# EAGLE schematic Cosmic Pi V2 (EAGLE 9.1.0)

## Sheet 1 of 2
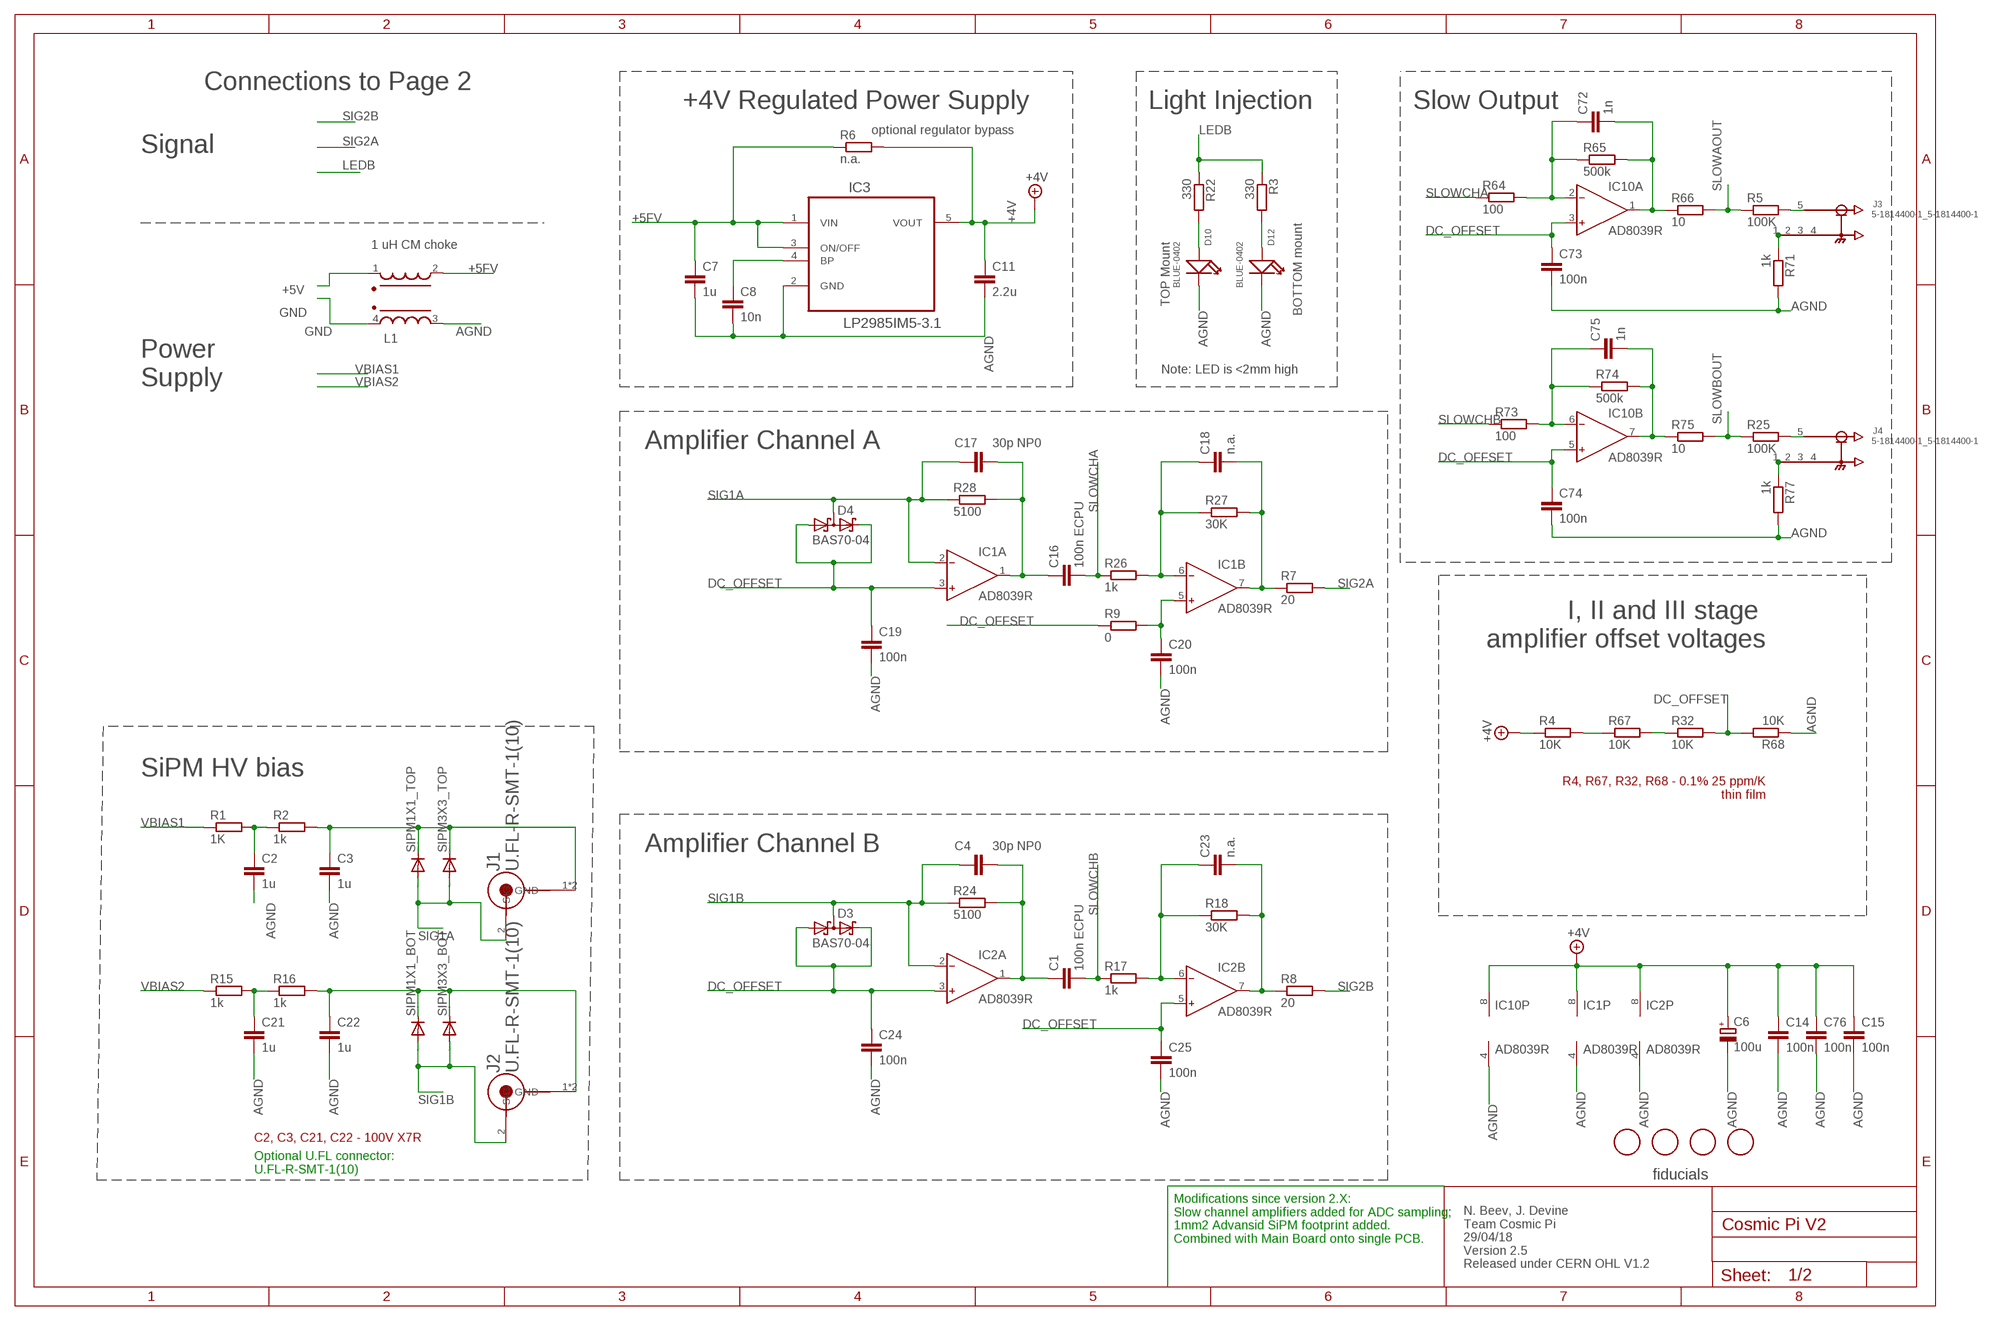
[diagram p0: schematic, sheet 1]

### Parts
C1  100n ECPU  C-EUC0805  [C0805]
C2  1u  C-EUC1206  [C1206]
C3  1u  C-EUC1206  [C1206]
C4  30p NP0  C-EUC0603  [C0603]
C6  100u  CPOL-EUC/6032-28R  [C/6032-28R]
C7  1u  C-EUC0603  [C0603]
C8  10n  C-EUC0603  [C0603]
C11  2.2u  C-EUC0603  [C0603]
C14  100n  C-EUC0603  [C0603]
C15  100n  C-EUC0603  [C0603]
C16  100n ECPU  C-EUC0805  [C0805]
C17  30p NP0  C-EUC0603  [C0603]
C18  n.a.  C-EUC0603  [C0603]
C19  100n  C-EUC0603  [C0603]
C20  100n  C-EUC0603  [C0603]
C21  1u  C-EUC1206  [C1206]
C22  1u  C-EUC1206  [C1206]
C23  n.a.  C-EUC0603  [C0603]
C24  100n  C-EUC0603  [C0603]
C25  100n  C-EUC0603  [C0603]
C72  1n  C-EUC0603  [C0603]
C73  100n  C-EUC0603  [C0603]
C74  100n  C-EUC0603  [C0603]
C75  1n  C-EUC0603  [C0603]
C76  100n  C-EUC0603  [C0603]
D3  BAS70-04  [SOT23]
D4  BAS70-04  [SOT23]
D10  BLUE-0402  SMD-LED-CLEAR-BLUE(0402)  [LED-0402]
D12  BLUE-0402  SMD-LED-CLEAR-BLUE(0402)  [LED-0402]
IC1  AD8039R  [SO8]
IC2  AD8039R  [SO8]
IC3  LP2985IM5-3.1  [SOT95P284X120-5N]
IC10  AD8039R  [SO8]
J1  U.FL-R-SMT-1(10)  [HRS_U.FL-R-SMT-1(10)]
J2  U.FL-R-SMT-1(10)  [HRS_U.FL-R-SMT-1(10)]
J3  5-1814400-1_5-1814400-1  [5-1814400-1_TE_5-1814400-1]
J4  5-1814400-1_5-1814400-1  [5-1814400-1_TE_5-1814400-1]
L1  1 uH CM choke  WE-CNSW_1812_744235601  [WE-CNSW_1812]
R1  1K  R-EU_R1206  [R1206]
R2  1k  R-EU_R1206  [R1206]
R3  330  R-EU_R0603  [R0603]
R4  10K  R-EU_R0805  [R0805]
R5  100K  R-EU_R0603  [R0603]
R6  n.a.  R-EU_R0603  [R0603]
R7  20  R-EU_R0603  [R0603]
R8  20  R-EU_R0603  [R0603]
R9  0  R-EU_R1206  [R1206]
R15  1k  R-EU_R1206  [R1206]
R16  1k  R-EU_R1206  [R1206]
R17  1k  R-EU_R0603  [R0603]
R18  30K  R-EU_R0603  [R0603]
R22  330  R-EU_R0603  [R0603]
R24  5100  R-EU_R0603  [R0603]
R25  100K  R-EU_R0603  [R0603]
R26  1k  R-EU_R0603  [R0603]
R27  30K  R-EU_R0603  [R0603]
R28  5100  R-EU_R0603  [R0603]
R32  10K  R-EU_R0805  [R0805]
R64  100  R-EU_R0603  [R0603]
R65  500k  R-EU_R0603  [R0603]
R66  10  R-EU_R0603  [R0603]
R67  10K  R-EU_R0805  [R0805]
R68  10K  R-EU_R0805  [R0805]
R71  1k  R-EU_R0603  [R0603]
R73  100  R-EU_R0603  [R0603]
R74  500k  R-EU_R0603  [R0603]
R75  10  R-EU_R0603  [R0603]
R77  1k  R-EU_R0603  [R0603]
SIPM1X1_BOT  DIODE_DIODE-ADVANSID1X1  [DIODE_ASD-NUV1S-P]
SIPM1X1_TOP  DIODE_DIODE-ADVANSID1X1  [DIODE_ASD-NUV1S-P]
SIPM3X3_BOT  DIODE_DIODE-ADVANSID3X3  [DIODE_ASD-NUV3S-P]
SIPM3X3_TOP  DIODE_DIODE-ADVANSID3X3  [DIODE_ASD-NUV3S-P]
U$2  FIDUCIAL  [FIDUCIAL_1MM]
U$3  FIDUCIAL  [FIDUCIAL_1MM]
U$4  FIDUCIAL  [FIDUCIAL_1MM]
U$5  FIDUCIAL  [FIDUCIAL_1MM]

### Nets
+4V: C6.+ C11.1 C14.1 C15.1 C76.1 IC1.8(P:V+) IC2.8(P:V+) IC3.5(VOUT) IC10.8(P:V+) R4.1 R6.2
+5FV: C7.1 IC3.1(VIN) IC3.3(ON/OFF) L1.2 R6.1
+5V: L1.1 ; also sheet 2
AGND: C2.2 C3.2 C6.- C7.2 C8.2 C11.2 C14.2 C15.2 C19.2 C20.2 C21.2 C22.2 C24.2 C25.2 C73.2 C74.2 C76.2 D10.- D12.- IC1.4(P:V-) IC2.4(P:V-) IC3.2(GND) IC10.4(P:V-) L1.3 R68.1 R71.2 R77.2
DC_OFFSET: C19.1 C24.1 C25.1 C73.1 C74.1 D3.1(A1) D3.2(C2) D4.1(A1) D4.2(C2) IC1.3(A:IN+) IC2.3(A:IN+) IC2.5(B:IN+) IC10.3(A:IN+) IC10.5(B:IN+) R9.1 R32.2 R68.2
GND: L1.4 ; also sheet 2
LEDB: R3.1 R22.1 ; also sheet 2
N$1: J3.5(SIG) R5.2
N$2: R4.2 R67.1
N$3: D12.+ R3.2
N$4: C8.1 IC3.4(BP)
N$5: C21.1 R15.2 R16.1
N$6: C18.2 IC1.7(B:OUT) R7.1 R27.2
N$7 [Comms]: C22.1 J2.1(GND) J2.3(GND) R16.2 SIPM1X1_BOT.P$1(C) SIPM3X3_BOT.P$1(C)
N$8: J4.5(SIG) R25.2
N$9: C23.2 IC2.7(B:OUT) R8.1 R18.2
N$11: C2.1 R1.2 R2.1
N$12: C72.1 IC10.2(A:IN-) R64.2 R65.1
N$13: C20.1 IC1.5(B:IN+) R9.2
N$18 [Comms]: C3.1 J1.1(GND) J1.3(GND) R2.2 SIPM1X1_TOP.P$1(C) SIPM3X3_TOP.P$1(C)
N$20: D10.+ R22.2
N$21: R32.1 R67.2
N$23: C1.1 C4.2 IC2.1(A:OUT) R24.2
N$24: J4.1(GND) R77.1
N$25: C23.1 IC2.6(B:IN-) R17.2 R18.1
N$31: C16.1 C17.2 IC1.1(A:OUT) R28.2
N$32: C72.2 IC10.1(A:OUT) R65.2 R66.1
N$33: C18.1 IC1.6(B:IN-) R26.2 R27.1
N$59: C75.1 IC10.6(B:IN-) R73.2 R74.1
N$76: J3.1(GND) R71.1
N$77: C75.2 IC10.7(B:OUT) R74.2 R75.1
SIG1A [Comms]: C17.1 D4.3(C1A2) IC1.2(A:IN-) J1.2(SIG) R28.1 SIPM1X1_TOP.P$2(A) SIPM3X3_TOP.P$2(A)
SIG1B [Comms]: C4.1 D3.3(C1A2) IC2.2(A:IN-) J2.2(SIG) R24.1 SIPM1X1_BOT.P$2(A) SIPM3X3_BOT.P$2(A)
SIG2A [Comms]: R7.2 ; also sheet 2
SIG2B [Comms]: R8.2 ; also sheet 2
SLOWAOUT: R5.1 R66.2 ; also sheet 2
SLOWBOUT: R25.1 R75.2 ; also sheet 2
SLOWCHA [Comms]: C16.2 R26.1 R64.1
SLOWCHB: C1.2 R17.1 R73.1
VBIAS1: R1.1 ; also sheet 2
VBIAS2: R15.1 ; also sheet 2
Unconnected: J3.2(GND) J3.3(GND) J3.4(GND) J4.2(GND) J4.3(GND) J4.4(GND)

### Notes on the sheet
- Connections to Page 2
- +4V Regulated Power Supply | Light Injection | Slow Output
- optional regulator bypass
- Signal
- Note: LED is <2mm high
- Power
  Supply
- Amplifier Channel A
- I, II and III stage 
  amplifier offset voltages
- SiPM HV bias
- R4, R67, R32, R68 - 0.1% 25 ppm/K
  thin film
- Amplifier Channel B
- C2, C3, C21, C22 - 100V X7R
- Optional U.FL connector:
  U.FL-R-SMT-1(10)
- fiducials
- Modifications since version 2.X:
  Slow channel amplifiers added for ADC sampling;
  1mm2 Advansid SiPM footprint added.
  Combined with Main Board onto single PCB.
- N. Beev, J. Devine
  Team Cosmic Pi
  29/04/18
  Version 2.5
  Released under CERN OHL V1.2

## Sheet 2 of 2
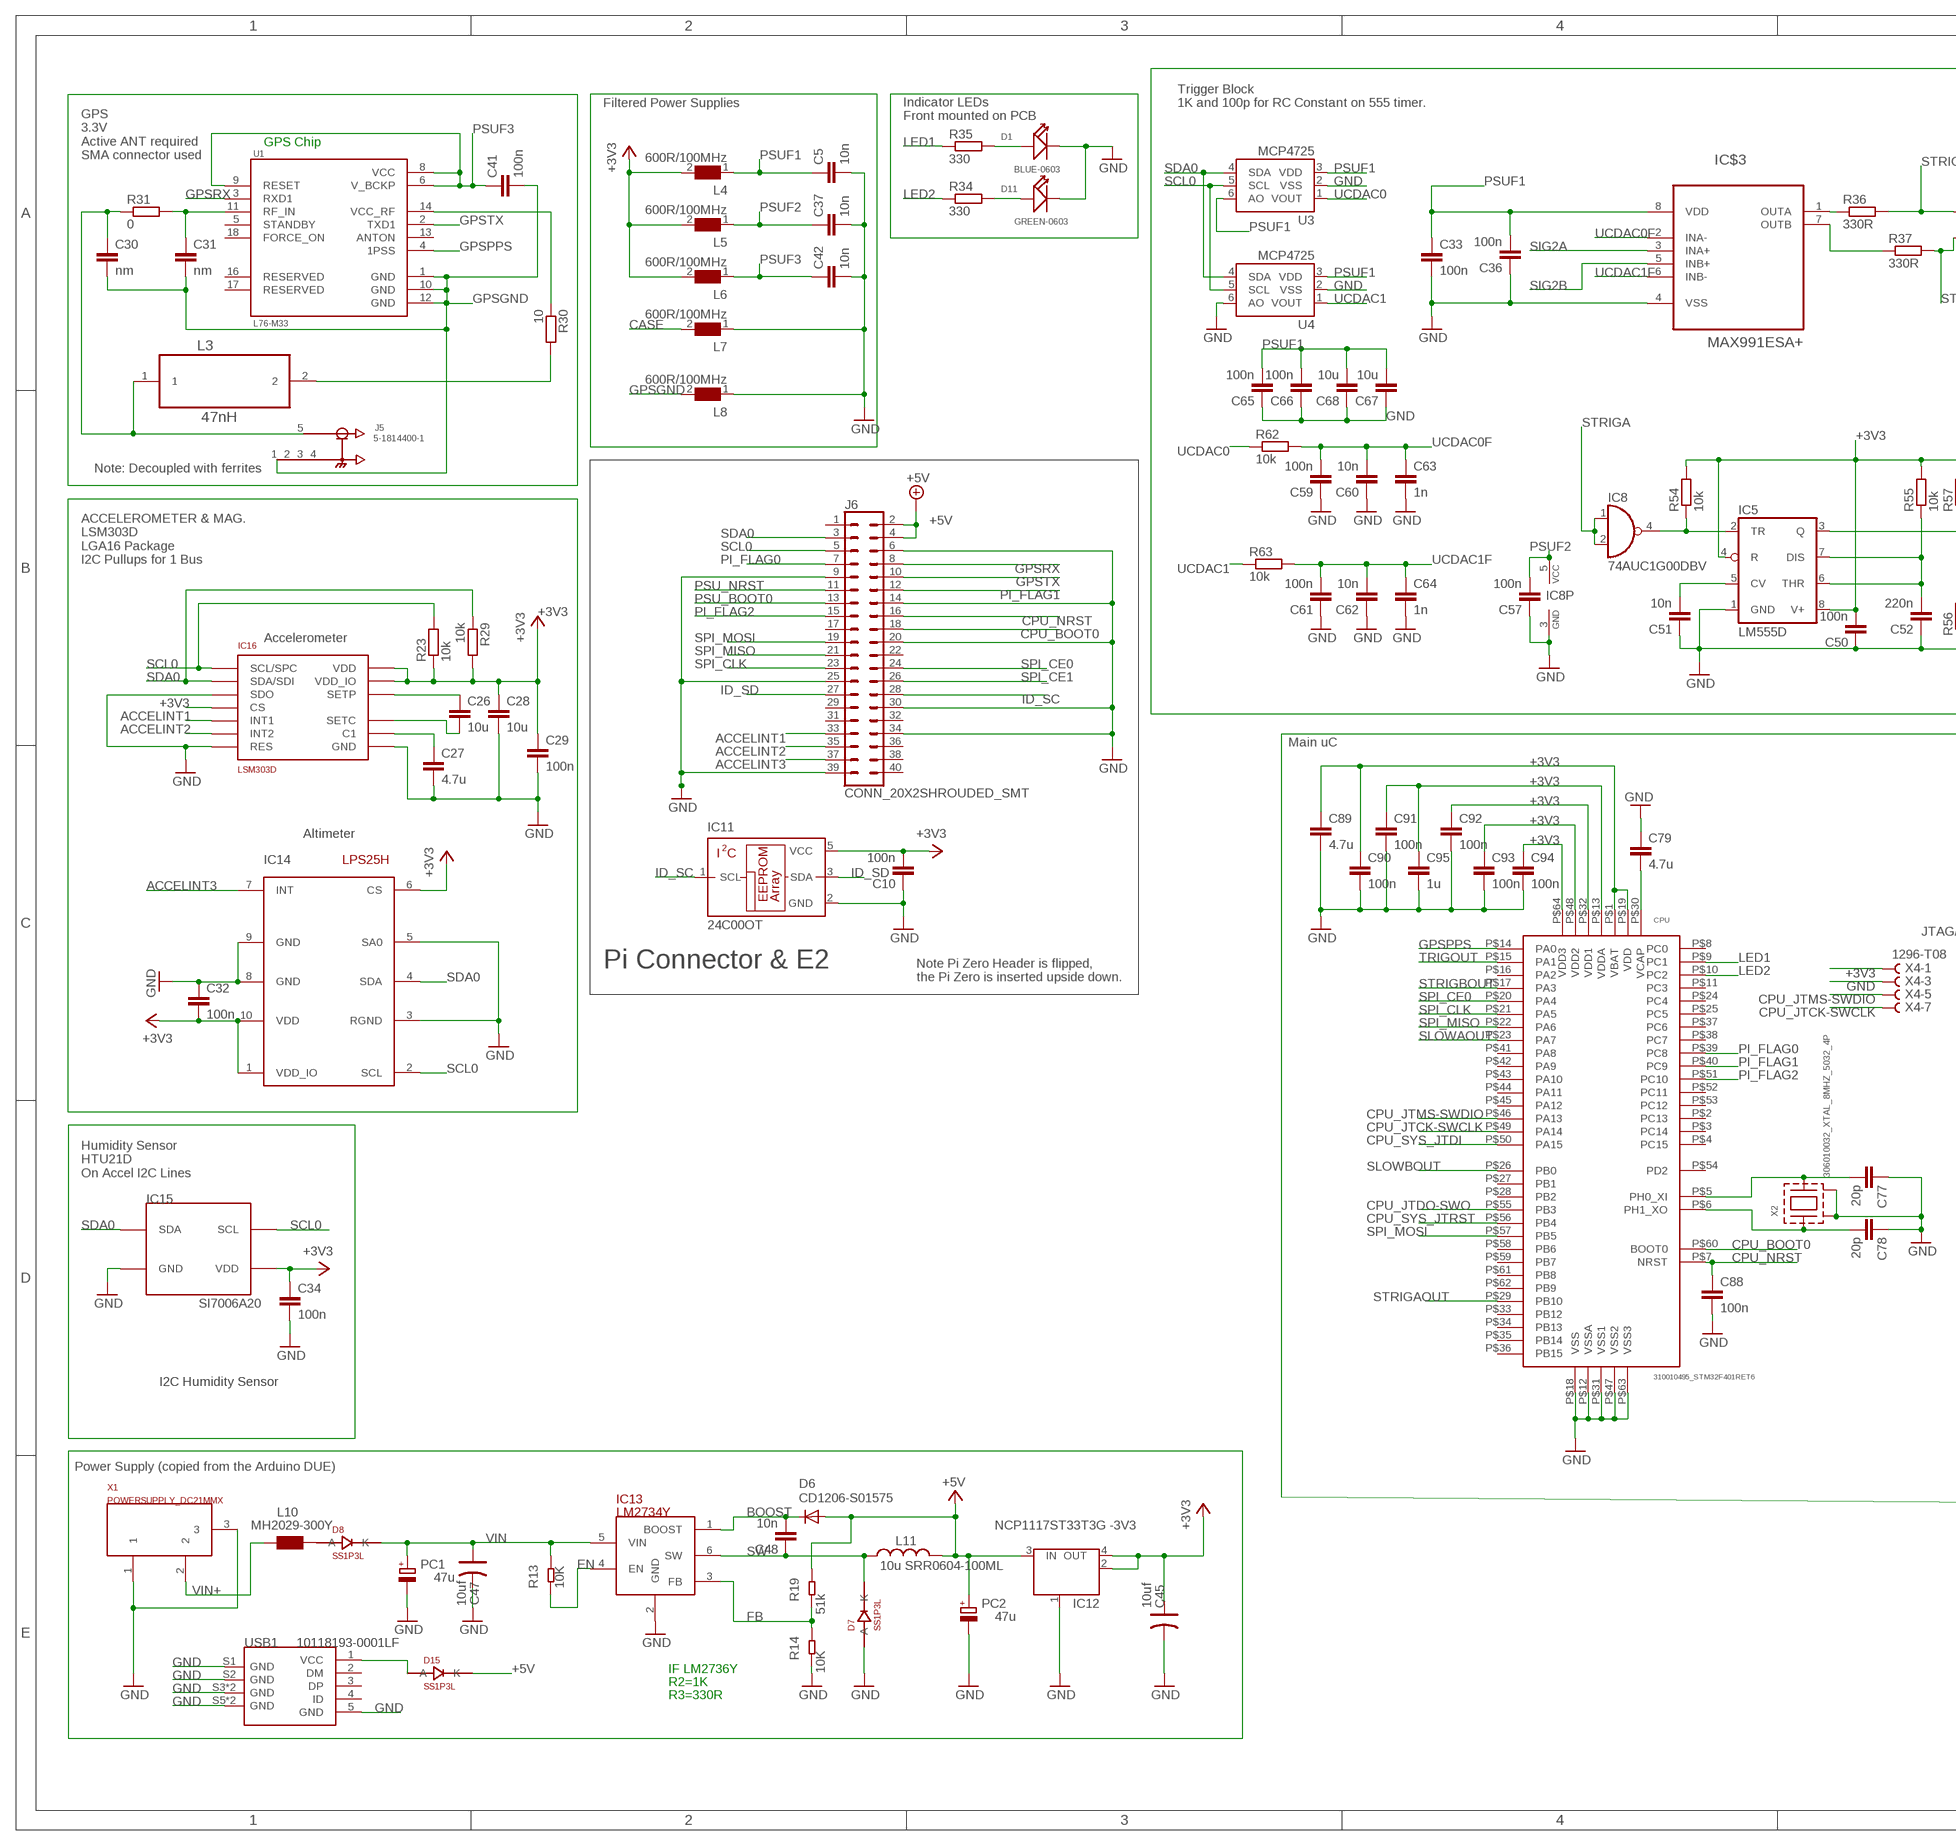
[diagram p1: schematic, sheet 2, part 1 of 2]
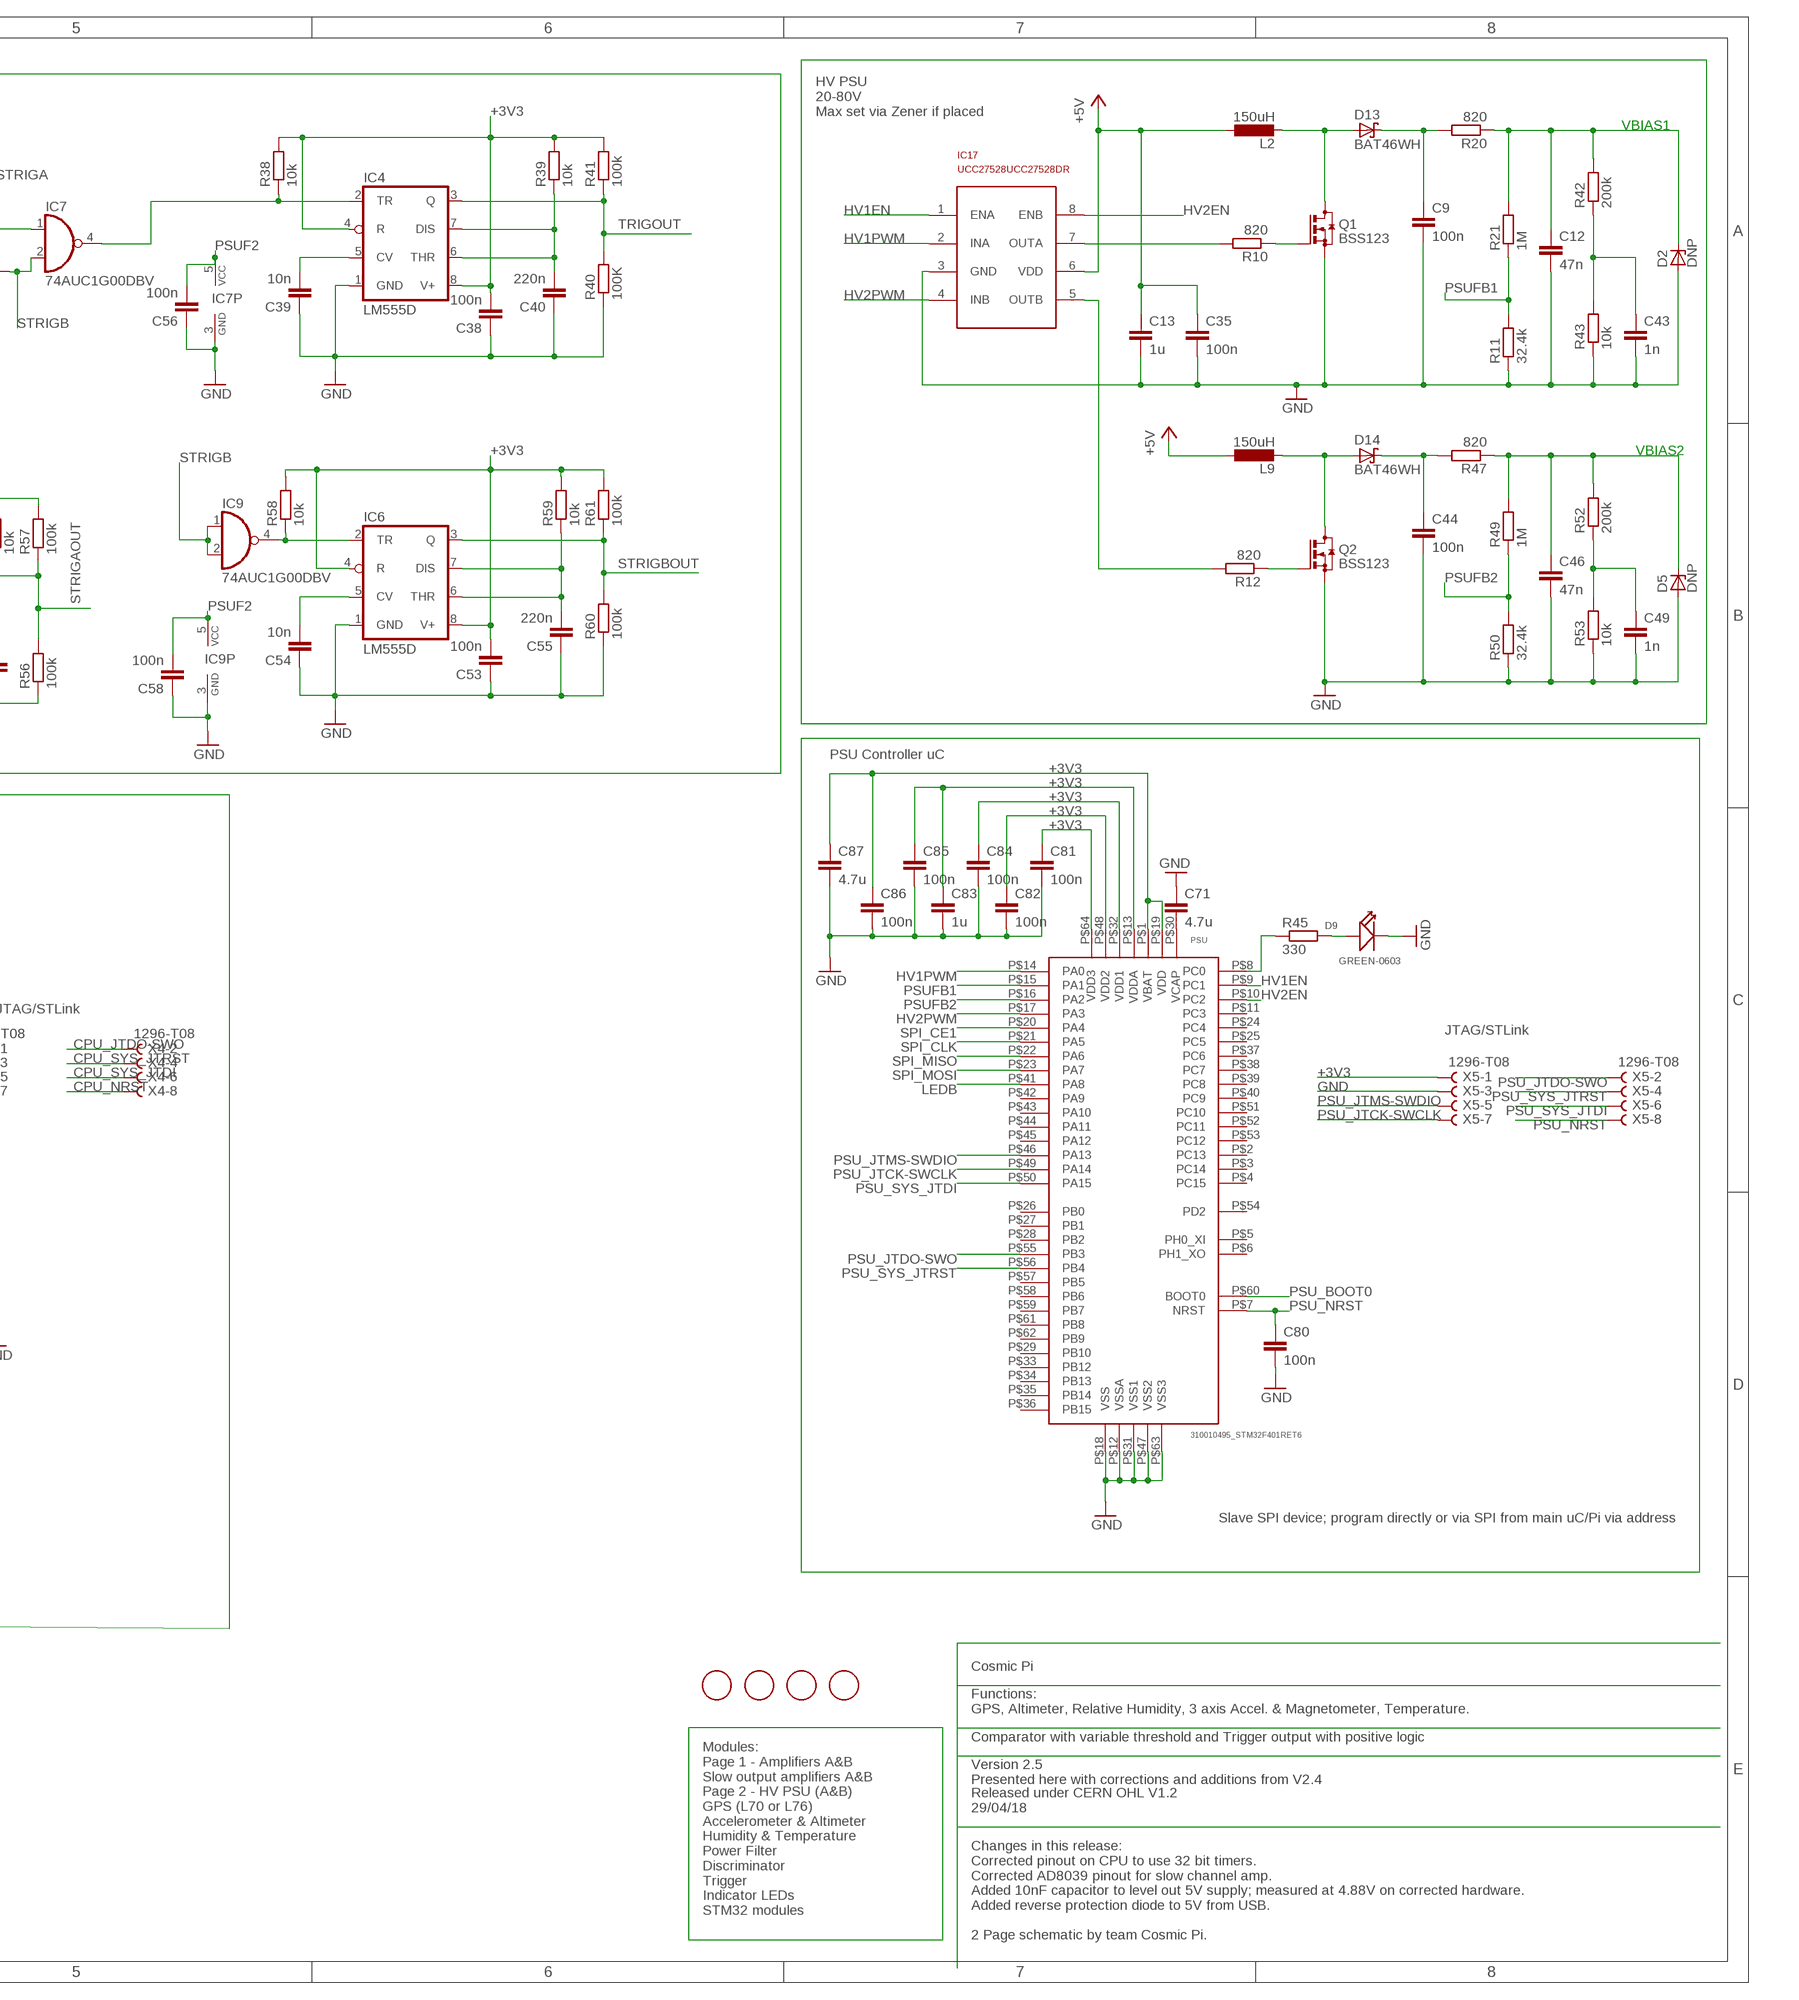
[diagram p2: schematic, sheet 2, part 2 of 2]

### Parts
C5  10n  C-EUC0603  [C0603]
C9  100n  C-EUC0603  [C0603]
C10  100n  C-EUC0603  [C0603]
C12  47n  C-EUC0603  [C0603]
C13  1u  C-EUC0603  [C0603]
C26  10u  C-EUC0603  [C0603]
C27  4.7u  C-EUC0603  [C0603]
C28  10u  C-EUC0603  [C0603]
C29  100n  C-EUC0603  [C0603]
C30  nm  C-EUC0603  [C0603]
C31  nm  C-EUC0603  [C0603]
C32  100n  C-EUC0603  [C0603]
C33  100n  C-EUC0603  [C0603]
C34  100n  C-EUC0603  [C0603]
C35  100n  C-EUC0603  [C0603]
C36  100n  C-EUC0603  [C0603]
C37  10n  C-EUC0603  [C0603]
C38  100n  C-EUC0603  [C0603]
C39  10n  C-EUC0603  [C0603]
C40  220n  C-EUC0603  [C0603]
C41  100n  C-EUC0603  [C0603]
C42  10n  C-EUC0603  [C0603]
C43  1n  C-EUC0603  [C0603]
C44  100n  C-EUC0603  [C0603]
C45  10uf  TANTALUM-SMD-10UF-16V-10%(AVX-A)  [AVX-A]
C46  47n  C-EUC0603  [C0603]
C47  10uf  TANTALUM-SMD-10UF-16V-10%(AVX-A)  [AVX-A]
C48  10n  C-EUC0603  [C0603]
C49  1n  C-EUC0603  [C0603]
C50  100n  C-EUC0603  [C0603]
C51  10n  C-EUC0603  [C0603]
C52  220n  C-EUC0603  [C0603]
C53  100n  C-EUC0603  [C0603]
C54  10n  C-EUC0603  [C0603]
C55  220n  C-EUC0603  [C0603]
C56  100n  C-EUC0603  [C0603]
C57  100n  C-EUC0603  [C0603]
C58  100n  C-EUC0603  [C0603]
C59  100n  C-EUC0603  [C0603]
C60  10n  C-EUC0603  [C0603]
C61  100n  C-EUC0603  [C0603]
C62  10n  C-EUC0603  [C0603]
C63  1n  C-EUC0603  [C0603]
C64  1n  C-EUC0603  [C0603]
C65  100n  C-EUC0603  [C0603]
C66  100n  C-EUC0603  [C0603]
C67  10u  C-EUC0603  [C0603]
C68  10u  C-EUC0603  [C0603]
C71  4.7u  C-EUC0603  [C0603]
C77  20p  C-EUC0603  [C0603]
C78  20p  C-EUC0603  [C0603]
C79  4.7u  C-EUC0603  [C0603]
C80  100n  C-EUC0603  [C0603]
C81  100n  C-EUC0603  [C0603]
C82  100n  C-EUC0603  [C0603]
C83  1u  C-EUC0603  [C0603]
C84  100n  C-EUC0603  [C0603]
C85  100n  C-EUC0603  [C0603]
C86  100n  C-EUC0603  [C0603]
C87  4.7u  C-EUC0603  [C0603]
C88  100n  C-EUC0603  [C0603]
C89  4.7u  C-EUC0603  [C0603]
C90  100n  C-EUC0603  [C0603]
C91  100n  C-EUC0603  [C0603]
C92  100n  C-EUC0603  [C0603]
C93  100n  C-EUC0603  [C0603]
C94  100n  C-EUC0603  [C0603]
C95  1u  C-EUC0603  [C0603]
CPU  310010495_STM32F401RET6  [LQFP64]
D1  BLUE-0603  SMD-LED-CLEAR-BLUE(0603)  [LED-0603]
D2  DNP  ZENER-DIODESOT23  [SOT23]
D5  DNP  ZENER-DIODESOT23  [SOT23]
D6  CD1206-S01575  DIODE-MINIMELF  [MINIMELF]
D7  SS1P3L  [DO220AAL]
D8  SS1P3L  [DO220AAL]
D9  GREEN-0603  SMD-LED-CLEAR-GREEN(0603)  [LED-0603]
D11  GREEN-0603  SMD-LED-CLEAR-GREEN(0603)  [LED-0603]
D13  BAT46WH  [SOD123F]
D14  BAT46WH  [SOD123F]
D15  SS1P3L  [DO220AAL]
IC4  LM555D  [SO08]
IC5  LM555D  [SO08]
IC6  LM555D  [SO08]
IC7  74AUC1G00DBV  [SOT23-5]
IC8  74AUC1G00DBV  [SOT23-5]
IC9  74AUC1G00DBV  [SOT23-5]
IC11  24C00OT  [SOT23-5L]
IC12  NCP1117ST33T3G -3V3  MC33269ST-3.3T3  [SOT223]
IC13  LM2734Y  LM2736Y  [SOT23-6]
IC14  LPS25H  [LPS25H]
IC15  SI7006A20  [3X3DFN]
IC16  LSM303D  [LGA16L]
IC17  UCC27528UCC27528DR  [ANALOG-DEVICES_SO8]
IC$3  MAX991ESA+  [SOIC-8]
J5  5-1814400-1  [TE_5-1814400-1]
J6  CONN_20X2SHROUDED_SMT  [2X20_SHROUDED_SMT]
L2  150uH  L-EUL1812  [L1812]
L3  47nH  B82496C3470J  [INDC1608X90N]
L4  600R/100MHz  WE-CBF-74279218_1206  [1206]
L5  600R/100MHz  WE-CBF-74279218_1206  [1206]
L6  600R/100MHz  WE-CBF-74279218_1206  [1206]
L7  600R/100MHz  WE-CBF-74279218_1206  [1206]
L8  600R/100MHz  WE-CBF-74279218_1206  [1206]
L9  150uH  L-EUL1812  [L1812]
L10  MH2029-300Y  WE-CBF_0805  [0805]
L11  10u SRR0604-100ML  L-USSRR0604  [SRR0604]
PC1  47u  CPOL-EUD  [PANASONIC_D]
PC2  47u  CPOL-EUD  [PANASONIC_D]
PSU  310010495_STM32F401RET6  [LQFP64]
Q1  BSS123  [SOT23]
Q2  BSS123  [SOT23]
R10  820  R-EU_R0603  [R0603]
R11  32.4k  R-EU_R0603  [R0603]
R12  820  R-EU_R0603  [R0603]
R13  10K  SMD-RES-10K-1%-1/10W(0603)  [R0603]
R14  10K  SMD-RES-10K-1%-1/10W(0603)  [R0603]
R19  51k  SMD-RES-51K-5%-1/10W(0603)  [R0603]
R20  820  R-EU_R0603  [R0603]
R21  1M  R-EU_R0603  [R0603]
R23  10k  R-EU_R0603  [R0603]
R29  10k  R-EU_R0603  [R0603]
R30  10  R-EU_R0603  [R0603]
R31  0  R-EU_R0603  [R0603]
R34  330  R-EU_R0603  [R0603]
R35  330  R-EU_R0603  [R0603]
R36  330R  R-EU_R0603  [R0603]
R37  330R  R-EU_R0603  [R0603]
R38  10k  R-EU_R0603  [R0603]
R39  10k  R-EU_R0603  [R0603]
R40  100K  R-EU_R0603  [R0603]
R41  100k  R-EU_R0603  [R0603]
R42  200k  R-EU_R0603  [R0603]
R43  10k  R-EU_R0603  [R0603]
R45  330  R-EU_R0603  [R0603]
R47  820  R-EU_R0603  [R0603]
R49  1M  R-EU_R0603  [R0603]
R50  32.4k  R-EU_R0603  [R0603]
R52  200k  R-EU_R0603  [R0603]
R53  10k  R-EU_R0603  [R0603]
R54  10k  R-EU_R0603  [R0603]
R55  10k  R-EU_R0603  [R0603]
R56  100k  R-EU_R0603  [R0603]
R57  100k  R-EU_R0603  [R0603]
R58  10k  R-EU_R0603  [R0603]
R59  10k  R-EU_R0603  [R0603]
R60  100k  R-EU_R0603  [R0603]
R61  100k  R-EU_R0603  [R0603]
R62  10k  R-EU_R0603  [R0603]
R63  10k  R-EU_R0603  [R0603]
U1  L76-M33  [CAPCAV110P970X1010X250-18N]
U3  MCP4725  MCP4725SOT-23  [SOT23-6]
U4  MCP4725  MCP4725SOT-23  [SOT23-6]
U$1  FIDUCIAL  [FIDUCIAL_1MM]
U$6  FIDUCIAL  [FIDUCIAL_1MM]
U$7  FIDUCIAL  [FIDUCIAL_1MM]
U$8  FIDUCIAL  [FIDUCIAL_1MM]
USB1  10118193-0001LF  MICRO-USB-SMD-B-(10118193-0001LF)  [MICRO-USB5+6P-SMD-0.65-B]
X1  POWERSUPPLY_DC21MMX  [POWERSUPPLY_DC-21MM]
X2  306010032_XTAL_8MHZ_5032_4P  [X5032_4P]
X4  1296-T08  [1296-08]
X5  1296-T08  [1296-08]

### Nets
+3V3: C10.2 C28.1 C29.1 C32.2 C34.1 C38.2 C45.+ C50.2 C53.2 C81.1 C82.1 C83.1 C84.1 C85.1 C86.1 C87.1 C89.1 C90.1 C91.1 C92.1 C93.1 C94.1 C95.1 CPU.P$1(VBAT) CPU.P$13(VDDA) CPU.P$19(VDD) CPU.P$32(VDD1) CPU.P$48(VDD2) CPU.P$64(VDD3) IC4.4(R) IC4.8(V+) IC5.4(R) IC5.8(V+) IC6.4(R) IC6.8(V+) IC11.5(VCC) IC12.2(OUT) IC12.4(OUT) IC14.1(VDD_IO) IC14.6(CS) IC14.10(VDD) IC15.P$5(VDD) IC16.P$1(VDD_IO) IC16.P$8(CS) IC16.P$14(VDD) L4.2 L5.2 L6.2 PSU.P$1(VBAT) PSU.P$13(VDDA) PSU.P$19(VDD) PSU.P$32(VDD1) PSU.P$48(VDD2) PSU.P$64(VDD3) R23.1 R29.2 R38.2 R39.2 R41.2 R54.2 R55.2 R57.2 R58.2 R59.2 R61.2 X4.1 X5.1
+5V: C13.1 C35.1 D6.A D15.P$1(K) IC12.3(IN) IC17.6(VDD) J6.2 J6.4 L2.1 L9.1 L11.P$2 PC2.+ R19.1 ; also sheet 1
ACCELINT1: IC16.P$11(INT1) J6.33
ACCELINT2: IC16.P$9(INT2) J6.35
ACCELINT3: IC14.7(INT) J6.37
BOOST: C48.2 D6.C IC13.1(BOOST)
CASE: L7.2
CPU_BOOT0: CPU.P$60(BOOT0) J6.18
CPU_JTCK-SWCLK: CPU.P$49(PA14) X4.7
CPU_JTDO-SWO: CPU.P$55(PB3) X4.2
CPU_JTMS-SWDIO: CPU.P$46(PA13) X4.5
CPU_NRST: C88.1 CPU.P$7(NRST) J6.16 X4.8
CPU_SYS_JTDI: CPU.P$50(PA15) X4.6
CPU_SYS_JTRST: CPU.P$56(PB4) X4.4
EN: IC13.4(EN) R13.2
FB: IC13.3(FB) R14.1 R19.2
GND: C5.2 C9.2 C10.1 C12.2 C13.2 C27.2 C28.2 C29.2 C32.1 C33.2 C34.2 C35.2 C36.1 C37.2 C38.1 C39.1 C40.1 C42.2 C43.2 C44.2 C45.- C46.2 C47.- C49.2 C50.1 C51.1 C52.1 C53.1 C54.1 C55.1 C56.1 C57.1 C58.1 C59.1 C60.1 C61.1 C62.1 C63.2 C64.2 C65.1 C66.1 C67.1 C68.1 C71.1 C77.1 C78.1 C79.1 C80.2 C81.2 C82.2 C83.2 C84.2 C85.2 C86.2 C87.2 C88.2 C89.2 C90.2 C91.2 C92.2 C93.2 C94.2 C95.2 CPU.P$12(VSSA) CPU.P$18(VSS) CPU.P$31(VSS1) CPU.P$47(VSS2) CPU.P$63(VSS3) D1.- D2.1(A) D5.1(A) D7.P$2(A) D9.- D11.- IC4.1(GND) IC5.1(GND) IC6.1(GND) IC7.3(GND) IC8.3(GND) IC9.3(GND) IC11.2(GND) IC12.1(GND/ADJ) IC13.2(GND) IC14.3(RGND) IC14.5(SA0) IC14.8(GND) IC14.9(GND) IC15.P$2(GND) IC16.P$5(GND) IC16.P$7(SDO) IC16.P$10(RES) IC16.P$12(GND) IC16.P$13(GND) IC16.P$16(GND) IC17.3(GND) IC$3.4(VSS) J6.6 J6.9 J6.14 J6.20 J6.25 J6.30 J6.34 J6.39 L7.1 L8.1 PC1.- PC2.- PSU.P$12(VSSA) PSU.P$18(VSS) PSU.P$31(VSS1) PSU.P$47(VSS2) PSU.P$63(VSS3) Q1.2(S) Q2.2(S) R11.1 R14.2 R40.1 R43.1 R50.1 R53.1 R56.1 R60.1 U3.2(VSS) U4.2(VSS) U4.6(AO) USB1.5(GND) USB1.S1(GND) USB1.S2(GND) USB1.S3(GND) USB1.S4(GND) USB1.S5(GND) USB1.S6(GND) X1.1 X1.3 X2.P$2(GND1) X2.P$4(GND2) X4.3 X5.3 ; also sheet 1
GPSGND [ant]: C30.2 C31.2 C41.2 J5.1(GND) L8.2 U1.1(GND) U1.10(GND) U1.12(GND)
GPSPPS: CPU.P$14(PA0) U1.4(1PSS)
GPSRX: J6.8 U1.3(RXD1)
GPSTX: J6.10 U1.2(TXD1)
HV1EN: IC17.1(ENA) PSU.P$9(PC1)
HV1PWM: IC17.2(INA) PSU.P$14(PA0)
HV2EN: IC17.8(ENB) PSU.P$10(PC2)
HV2PWM: IC17.4(INB) PSU.P$17(PA3)
ID_SC: IC11.1(SCL) J6.28
ID_SD: IC11.3(SDA) J6.27
LED1: CPU.P$9(PC1) R35.1
LED2: CPU.P$10(PC2) R34.1
LEDB: PSU.P$41(PA8) ; also sheet 1
N$10: D15.P$2(A) USB1.1(VCC)
N$16: D13.2(A) L2.2 Q1.3(D)
N$19: Q1.1(G) R10.1
N$22: C39.2 IC4.5(CV)
N$26: C40.2 IC4.6(THR) IC4.7(DIS) R39.1
N$27: Q2.1(G) R12.1
N$28: D14.2(A) L9.2 Q2.3(D)
N$30: C44.1 D14.1(K) R47.2
N$34: IC17.5(OUTB) R12.2
N$35: D9.+ R45.2
N$36: PSU.P$8(PC0) R45.1
N$39: C51.2 IC5.5(CV)
N$40: C52.2 IC5.6(THR) IC5.7(DIS) R55.1
N$41: C54.2 IC6.5(CV)
N$42: C55.2 IC6.6(THR) IC6.7(DIS) R59.1
N$43: IC4.2(TR) IC7.4(O) R38.1
N$44: IC6.2(TR) IC9.4(O) R58.1
N$45: IC5.2(TR) IC8.4(O) R54.1
N$46: IC$3.1(OUTA) R36.1
N$47: IC17.7(OUTA) R10.2
N$48: IC$3.7(OUTB) R37.1
N$53 [ant]: C30.1 J5.5(SIG) L3.1 R31.1
N$55: D8.P$2(A) L10.1
N$62: C71.2 PSU.P$30(VCAP)
N$63: C26.1 IC16.P$3(SETP)
N$64: C26.2 IC16.P$2(SETC)
N$65: C27.1 IC16.P$15(C1)
N$66 [ant]: L3.2 R30.2
N$67 [ant]: R30.1 U1.14(VCC_RF)
N$68 [ant]: C31.1 R31.2 U1.11(RF_IN)
N$72: D1.+ R35.2
N$73: D11.+ R34.2
N$75: C9.1 D13.1(K) R20.2
N$79: C77.2 CPU.P$5(PH0_XI) X2.P$3
N$81: C78.2 CPU.P$6(PH1_XO) X2.P$1
N$85: C79.2 CPU.P$30(VCAP)
PI_FLAG0: CPU.P$39(PC8) J6.7
PI_FLAG1: CPU.P$40(PC9) J6.12
PI_FLAG2: CPU.P$51(PC10) J6.15
PSU_BOOT0: J6.13 PSU.P$60(BOOT0)
PSU_JTCK-SWCLK: PSU.P$49(PA14) X5.7
PSU_JTDO-SWO: PSU.P$55(PB3) X5.2
PSU_JTMS-SWDIO: PSU.P$46(PA13) X5.5
PSU_NRST: C80.1 J6.11 PSU.P$7(NRST) X5.8
PSU_SYS_JTDI: PSU.P$50(PA15) X5.6
PSU_SYS_JTRST: PSU.P$56(PB4) X5.4
PSUF1: C5.1 C33.1 C36.2 C65.2 C66.2 C67.2 C68.2 IC$3.8(VDD) L4.1 U3.3(VDD) U3.6(AO) U4.3(VDD)
PSUF2: C37.1 C56.2 C57.2 C58.2 IC7.5(VCC) IC8.5(VCC) IC9.5(VCC) L5.1
PSUF3: C41.1 C42.1 L6.1 U1.6(V_BCKP) U1.8(VCC) U1.9(RESET)
PSUFB1: PSU.P$15(PA1) R11.2 R21.1
PSUFB2: PSU.P$16(PA2) R49.1 R50.2
SCL0: IC14.2(SCL) IC15.P$6(SCL) IC16.P$4(SCL/SPC) J6.5 R23.2 U3.5(SCL) U4.5(SCL)
SDA0: IC14.4(SDA) IC15.P$1(SDA) IC16.P$6(SDA/SDI) J6.3 R29.1 U3.4(SDA) U4.4(SDA)
SIG2A [Comms]: IC$3.3(INA+) ; also sheet 1
SIG2B [Comms]: IC$3.5(INB+) ; also sheet 1
SLOWAOUT: CPU.P$23(PA7) ; also sheet 1
SLOWBOUT: CPU.P$26(PB0) ; also sheet 1
SPI_CE0: CPU.P$20(PA4) J6.24
SPI_CE1: J6.26 PSU.P$20(PA4)
SPI_CLK: CPU.P$21(PA5) J6.23 PSU.P$21(PA5)
SPI_MISO: CPU.P$22(PA6) J6.21 PSU.P$22(PA6)
SPI_MOSI: CPU.P$57(PB5) J6.19 PSU.P$23(PA7)
STRIGA: IC7.1(I0) IC8.1(I0) IC8.2(I1) R36.2
STRIGAOUT: CPU.P$29(PB10) IC5.3(Q) R56.2 R57.1
STRIGB: IC7.2(I1) IC9.1(I0) IC9.2(I1) R37.2
STRIGBOUT: CPU.P$17(PA3) IC6.3(Q) R60.2 R61.1
SW: C48.1 D7.P$1(K) IC13.6(SW) L11.P$1
TRIGOUT: CPU.P$15(PA1) IC4.3(Q) R40.2 R41.1
UCDAC0: R62.1 U3.1(VOUT)
UCDAC0F: C59.2 C60.2 C63.1 IC$3.2(INA-) R62.2
UCDAC1: R63.1 U4.1(VOUT)
UCDAC1F: C61.2 C62.2 C64.1 IC$3.6(INB-) R63.2
VBIAS1: C12.1 D2.3(C) R20.1 R21.2 R42.2 ; also sheet 1
VBIAS2: C46.1 D5.3(C) R47.1 R49.2 R52.2 ; also sheet 1
VBIASFB1: C43.1 R42.1 R43.2
VBIASFB2: C49.1 R52.1 R53.2
VIN: C47.+ D8.P$1(K) IC13.5(VIN) PC1.+ R13.1
VIN+: L10.2 X1.2
Unconnected: CPU.P$2(PC13) CPU.P$3(PC14) CPU.P$4(PC15) CPU.P$8(PC0) CPU.P$11(PC3) CPU.P$16(PA2) CPU.P$24(PC4) CPU.P$25(PC5) CPU.P$27(PB1) CPU.P$28(PB2) CPU.P$33(PB12) CPU.P$34(PB13) CPU.P$35(PB14) CPU.P$36(PB15) CPU.P$37(PC6) CPU.P$38(PC7) CPU.P$41(PA8) CPU.P$42(PA9) CPU.P$43(PA10) CPU.P$44(PA11) CPU.P$45(PA12) CPU.P$52(PC11) CPU.P$53(PC12) CPU.P$54(PD2) CPU.P$58(PB6) CPU.P$59(PB7) CPU.P$61(PB8) CPU.P$62(PB9) J5.2(GND) J5.3(GND) J5.4(GND) J6.1 J6.17 J6.22 J6.29 J6.31 J6.32 J6.36 J6.38 J6.40 PSU.P$2(PC13) PSU.P$3(PC14) PSU.P$4(PC15) PSU.P$5(PH0_XI) PSU.P$6(PH1_XO) PSU.P$11(PC3) PSU.P$24(PC4) PSU.P$25(PC5) PSU.P$26(PB0) PSU.P$27(PB1) PSU.P$28(PB2) PSU.P$29(PB10) PSU.P$33(PB12) PSU.P$34(PB13) PSU.P$35(PB14) PSU.P$36(PB15) PSU.P$37(PC6) PSU.P$38(PC7) PSU.P$39(PC8) PSU.P$40(PC9) PSU.P$42(PA9) PSU.P$43(PA10) PSU.P$44(PA11) PSU.P$45(PA12) PSU.P$51(PC10) PSU.P$52(PC11) PSU.P$53(PC12) PSU.P$54(PD2) PSU.P$57(PB5) PSU.P$58(PB6) PSU.P$59(PB7) PSU.P$61(PB8) PSU.P$62(PB9) U1.5(STANDBY) U1.13(ANTON) U1.16(RESERVED) U1.17(RESERVED) U1.18(FORCE_ON) USB1.2(DM) USB1.3(DP) USB1.4(ID)

### Notes on the sheet
- Filtered Power Supplies
- Trigger Block
  1K and 100p for RC Constant on 555 timer.
- HV PSU
  20-80V
  Max set via Zener if placed
- Indicator LEDs
  Front mounted on PCB
- GPS Chip
- GPS
  3.3V
  Active ANT required
  SMA connector used
- Note: Decoupled with ferrites
- ACCELEROMETER & MAG.
  LSM303D
  LGA16 Package
  I2C Pullups for 1 Bus
- Accelerometer
- PSU Controller uC
- Main uC
- Altimeter
- JTAG/STLink
- JTAG/STLink
- Pi Connector & E2
- Note Pi Zero Header is flipped,
  the Pi Zero is inserted upside down.
- Humidity Sensor
  HTU21D
  On Accel I2C Lines
- I2C Humidity Sensor
- Slave SPI device; program directly or via SPI from main uC/Pi via address
- Power Supply (copied from the Arduino DUE)
- Cosmic Pi
- Functions:
  GPS, Altimeter, Relative Humidity, 3 axis Accel. & Magnetometer, Temperature.
- Modules:
  Page 1 - Amplifiers A&B
  Slow output amplifiers A&B
  Page 2 - HV PSU (A&B)
  GPS (L70 or L76)
  Accelerometer & Altimeter
  Humidity & Temperature
  Power Filter
  Discriminator
  Trigger
  Indicator LEDs
  STM32 modules
- Comparator with variable threshold and Trigger output with positive logic
- Version 2.5
  Presented here with corrections and additions from V2.4
- IF LM2736Y
- Released under CERN OHL V1.2
  29/04/18
- R2=1K
- R3=330R
- Changes in this release:
  Corrected pinout on CPU to use 32 bit timers.
  Corrected AD8039 pinout for slow channel amp.
  Added 10nF capacitor to level out 5V supply; measured at 4.88V on corrected hardware.
  Added reverse protection diode to 5V from USB.
- 2 Page schematic by team Cosmic Pi.

## Library data of the parts
C1-C4 C9 C12 C16-C18 C21-C23 C43 C44 C46 C49 C63 C64 C72 C75 C77 C78 = rcl:C-EU: CAPACITOR, European symbol
C5 C7 C8 C10 C11 C13-C15 C19 C20 C24-C42 C48 C50-C62 C65-C68 C71 C73 C74 C76 C79-C95 = resistor:C-EU: CAPACITOR, European symbol
C6 PC1 PC2 = rcl:CPOL-EU: POLARIZED CAPACITOR, European symbol
C45 C47 = Seeed-Capacitor:TANTALUM-SMD-10UF-16V-10%(AVX-A): 302020002; MPN: TAJA106K016RNJ
CPU PSU = Seeed-OPL-2017-01-IC-Akita:310010495_STM32F401RET6: ST;STM32F401RET6, SMD IC MCU;LQFP-64, SKU: 310010495
D1 = Seeed-LED:SMD-LED-CLEAR-BLUE(0603): 304090045; MPN: 19-217-BHC-ZL1M2RY-3T
D2 D5 = diode:ZENER-DIODE: Z-Diode
D3 D4 = diode:BAS70-04: Silicon Schottky Diodes General-purpose diode for high-speed switching
D6 = diode:DIODE-: DIODE
D7 D8 D15 = SmartPrj:SS1P3L
D9 D11 = Seeed-LED:SMD-LED-CLEAR-GREEN(0603): 304090043; MPN: 19-217-G7C-AN1P2-3T
D10 = Seeed-LED:SMD-LED-CLEAR-BLUE(0402): 304090075; MPN: BL-HB337A-AV-TRB; POSITION: TOP Mount
D12 = Seeed-LED:SMD-LED-CLEAR-BLUE(0402): 304090075; MPN: BL-HB337A-AV-TRB; POSITION: BOTTOM mount
D13 D14 = BAT46Wsymbol:BAT46W: Single Schottky barrier diode Single planar Schottky barrier diode with an integrated guard ring for stress protection, encapsulated in a Surface-Mounted Device (SMD) plastic package. AAL Eindhoven MK
IC1 IC2 IC10 = cosmicanalogue:AD8039: 2.7 V, 800 ?A, 80 MHz Rail-to-Rail I/O Amplifiers Source: http://www.analog.com/static/imported-files/data_sheets/AD8031_8032.pdf; MF: ALTERA CORPORATION; MPN: AD8033ARZ; OC_FARNELL: 8621519; OC_NEWARK: 59K6245
IC3 = LP2985IM5-3.1:LP2985IM5-3.1: Low-Dropout Regulator
IC4-IC6 = linear:*555: TIMER
IC7-IC9 = 74xx-little-de:74*1G00: 2-input NAND gate
IC11 = microchip:24C0*: Serial EEPROM 128 bit/1 K/2 K, I2C; MF: MICROCHIP; MPN: 24C00T-I/OT; OC_FARNELL: 1818713; OC_NEWARK: 92C6937
IC12 = linear:MC33269ST*: Adjustable Output Low Dropout Voltage Regulator 800 mA Source: http://www.onsemi.com/pub/Collateral/MC33269-D.PDF
IC13 = SmartPrj:LM2736Y
IC14 = LPS25H:LPS25H: ST-Micro Piezoresistive pressure sensor
IC15 = SI7006:SI7006
IC16 = LSM303D:LSM303D
IC17 = Cosmic Pi V2:UCC27528
IC$3 = MAX9916EKA_T:MAX991ESA+
J1 J2 = U.FL-R-SMT-1_10_:U.FL-R-SMT-1(10): U.FL, Ultra Miniature Coaxial Connector Receptacle, Male Pin 50 Ohm Surface Mount Solder; AVAILABILITY: Good; DESCRIPTION: U.FL Series 6 Ghz 50 Ohm Ultra-small SMT Coaxial Cable Receptacle; MF: Hirose; MP: U.FL-R-SMT-1(10); PACKAGE: None; PRICE: 0.73 USD
J3 J4 = Cosmic Pi V2:5-1814400-1_5-1814400-1: Conn SMA RCP 0Hz to 3GHz 50Ohm Solder RA Thru-Hole Gold Over Nickel Over Copper
J5 = 5-1814400-1:5-1814400-1: Conn SMA RCP 0Hz to 3GHz 50Ohm Solder RA Thru-Hole Gold Over Nickel Over Copper
J6 = SparkFun-Connectors:CONN_20X2: Multi connection point. Often used as Generic Header-pin footprint for 0.1 inch spaced/style header connections On any of the 0.1 inch spaced packages, you can populate with these: Break Away Headers - Straight <https://www.sparkfun.com/products/116> (PRT-00116) Break Away Male Headers - Right Angle <https://www.sparkfun.com/products/553> (PRT-00553) Female Headers <https://www.sparkfun.com/products/115> (PRT-00115) Break Away Headers - Machine Pin <https://www.sparkfun.com/products/117> (PRT-00117) Break Away Female Headers - Swiss Machine Pin <https://www.sparkfun.com/products/743> (PRT-00743); PROD_ID: CONN-13143
L1 = EMCComponents (rev17d):WE-CNSW_1812: WE-CNSW SMD Common Mode Line Filter Characteristics High common mode noise suppression at high frequencies Small influence on high speed signals through winding symmetry Operating temperature: –40 ºC to +125 ºC (Size 0805/1206/1812); –40 ºC to +105 ºC (Size 0603) Applications USB 2.0 IEEE 1394 (Firewire) LVDS High Speed Data Lines LAN <http://katalog.we-online.de/media/images/eisos/IndCNSW_pf2.jpg> Details see: http://katalog.we-online.de/en/pbs/WE-CNSW Updated by Dan Xu 2014-06-30 2014 (C) Wurth Elektronik; WE-NUMBER: 744235601/1uH
L2 L9 = rcl:L-EU: INDUCTOR, European symbol
L3 = B82496C3470J:B82496C3470J: INDUCTOR, 47NH 270MA 5%
L4-L8 = WE-CBF:WE-CBF: SMD EMI Suppression Ferrite Beads WE-CBF - Excellent anti-EMI properties - Low DC-restistance - Impedances till 3000 ohms - Rated current up to 6 A -- Reliable Ni-Sn electrodes -- Perfect as data lined filter and for uncoupling of distribution voltage; MPN: 74279218; OC_FARNELL: 1635758; OC_NEWARK: 08P2403; PACKAGE: IND-1206; SUPPLIER: Wuerth Elektronik
L10 = wuerth-elektronik:WE-CBF: SMD EMI Suppression Ferrite Beads - excellent anti-EMI properties - low DCR - impedances till 3000 ohms - rated current up to 6 A
L11 = SmartPrj:L-US: INDUCTOR, American symbol
Q1 Q2 = transistor-small-signal:BSS123: N-CHANNEL MOS FET
R1 R2 R4-R9 R15-R18 R24-R28 R32 R64-R68 R71 R73-R75 R77 = rcl:R-EU_: RESISTOR, European symbol
R3 R10-R12 R20-R23 R29-R31 R34-R43 R45 R47 R49 R50 R52-R63 = resistor:R-EU_: RESISTOR, European symbol
R13 R14 = Seeed-Resistor:SMD-RES-10K-1%-1/10W(0603): 301010299; MPN: RC0603FR-0710KL
R19 = Seeed-Resistor:SMD-RES-51K-5%-1/10W(0603): 301010145; MPN: RC0603JR-0751KL; VALUE: 51K
SIPM1X1_BOT SIPM1X1_TOP SIPM3X3_BOT SIPM3X3_TOP = Cosmic Pi V2:DIODE_DIODE-: DIODE
U1 = L76-M33:L76-M33: GPS Receiver 1575.42MHz 2.5V/3.3V 18-Pin
U3 U4 = SparkFun-IC-Conversion:MCP4725: MCP4725 DAC Microchip 12-bit I2C DAC, SOT23-6 Datasheet <https://cdn.sparkfun.com/datasheets/BreakoutBoards/MCP4725_2009.pdf> SparkFun Products SparkFun I2C DAC Breakout - MCP4725 <https://www.sparkfun.com/products/12918> (BOB-12918); PROD_ID: IC-08886
U$1-U$8 = adafruit:FIDUCIAL: For use by pick and place machines to calibrate the vision/machine, 1mm By microbuilder.eu
USB1 = Seeed-Connector:MICRO-USB-SMD-B-(10118193-0001LF): 320010003; MPN: 10118193-0001LF
X1 = SmartPrj:POWERSUPPLY_DC21MM
X2 = Seeed-OPL-2017-01-Crystal-Akita:306010032_XTAL_8MHZ_5032_4P: GX531S-8.000KKF1001, SMD Crystal 8MHz-10pF-10ppm-120R;4P-L5.0*W3.2*H0.8mm, SKU: 306010032
X4 X5 = con-leotronics:1296-T08: 1.27mm SINGLE ROW FEMALE SOCKET Source: http://www.leotronics.co.uk/Conexcon/Data%20Sheets/sec.%20A/1296ing.pdf; OC_FARNELL: unknown; OC_NEWARK: unknown

## Net classes
0 default: width 0.152 mm, drill 0.152 mm, clearance 0.152 mm
1 Peripheral: width 0.152 mm, drill 0.406 mm, clearance 0.152 mm
2 gnd: width 0.305 mm, drill 0.406 mm, clearance 0.254 mm
3 timing: width 0.152 mm, drill 0.406 mm, clearance 0.152 mm
4 Comms: width 0.152 mm, drill 0.406 mm, clearance 0.152 mm
5 PSU: width 0.152 mm, drill 0.406 mm, clearance 0.152 mm
6 Vbias: width 0.152 mm, drill 0.406 mm, clearance 0.356 mm
7 ant: width 0.61 mm, drill 0.406 mm, clearance 0.61 mm